# EAGLE design 01A-005 (EAGLE 9.6.2)
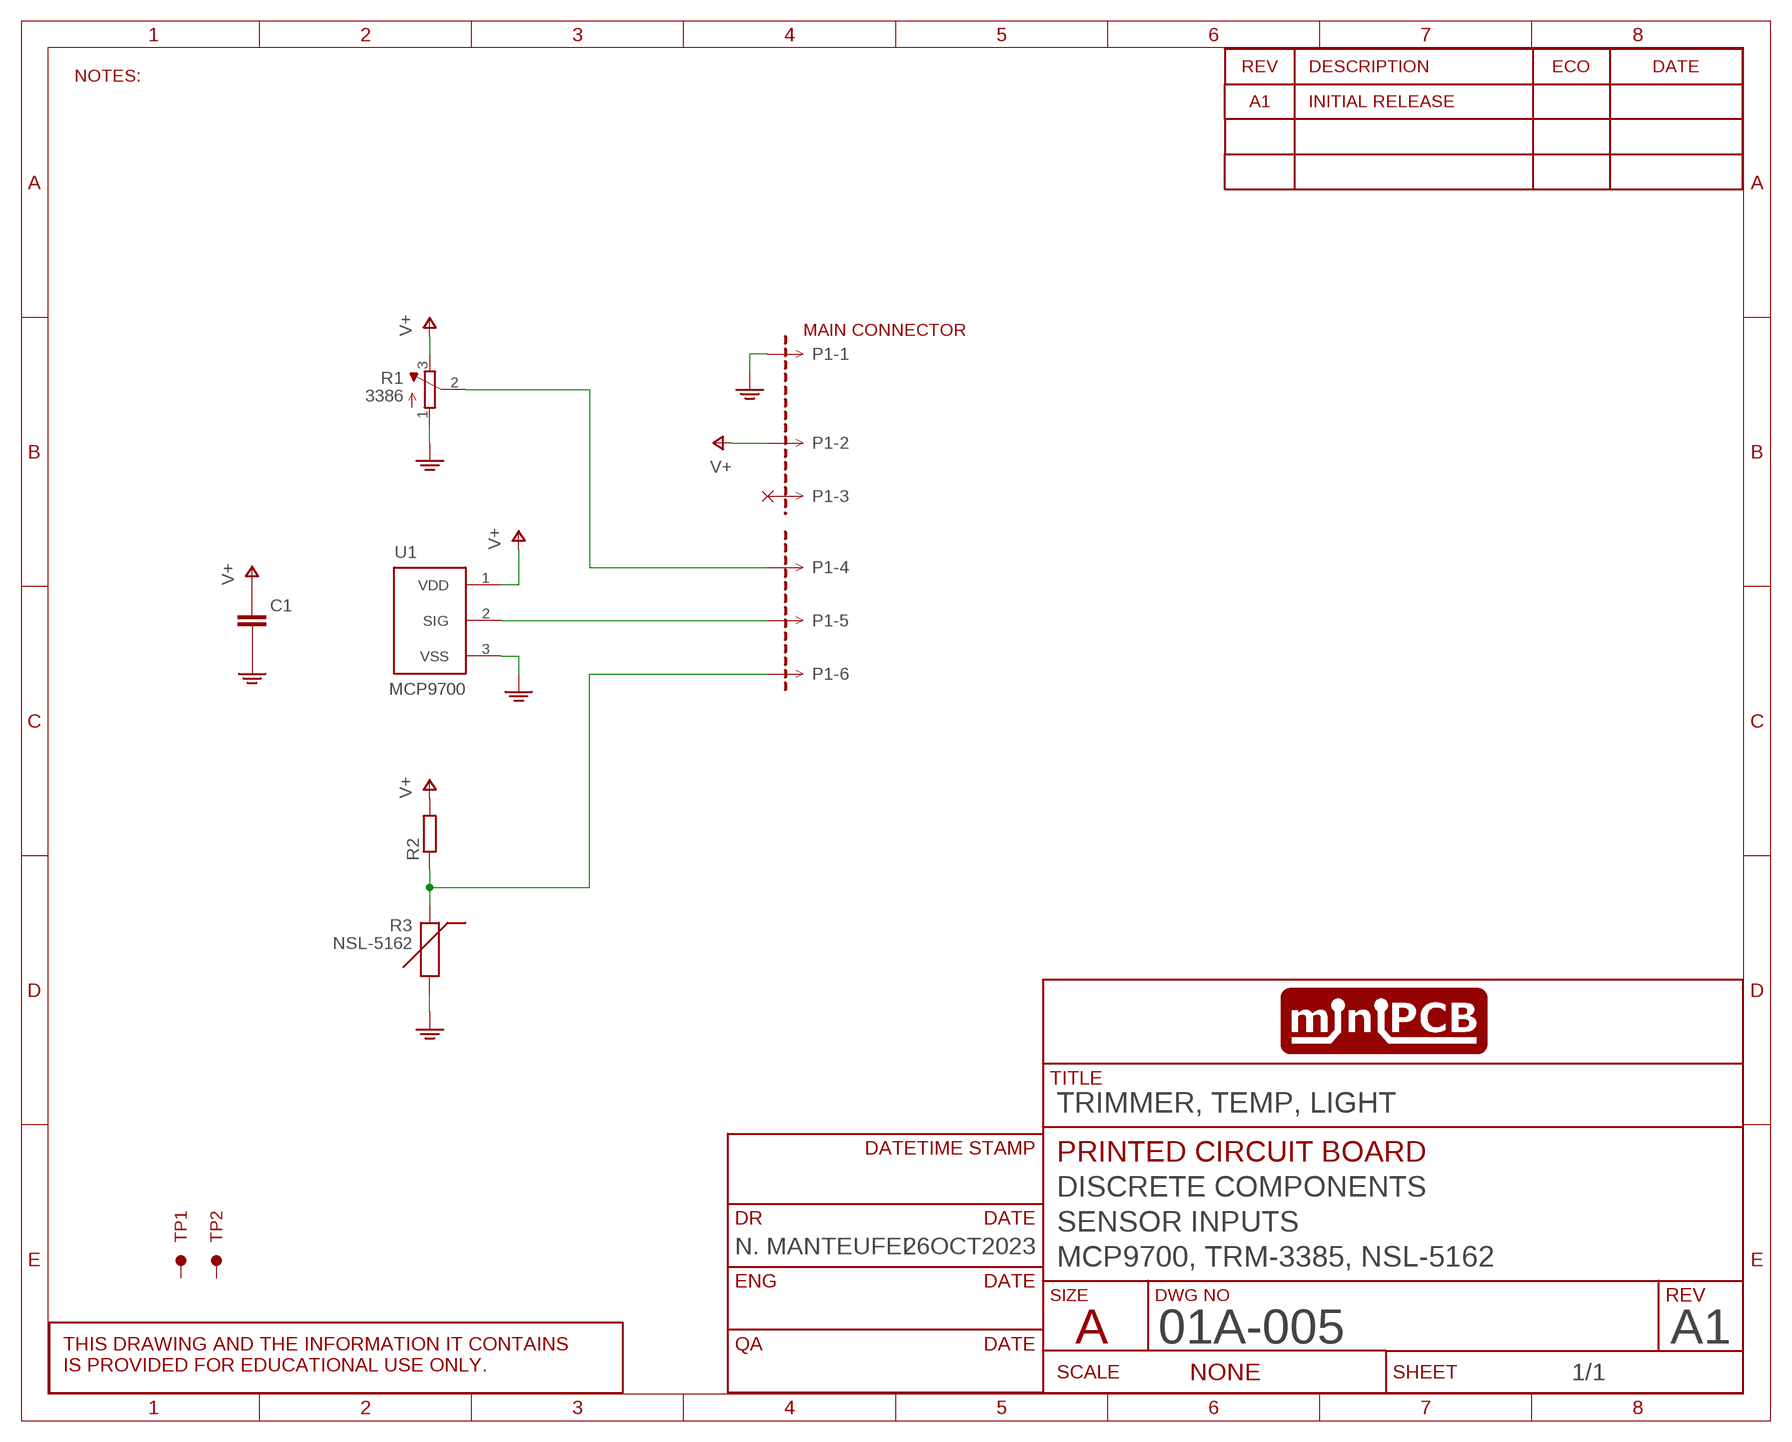
[diagram p0: schematic, sheet 1]
SHEET1 (SCHEMATIC): CIRCUIT_CATEGORY: DISCRETE COMPONENTS; CIRCUIT_NAME: SENSOR INPUTS; CIRCUIT_VARIANT: MCP9700, TRM-3385, NSL-5162; DR: N. MANTEUFEL; DR_DATE: 26OCT2023; PCB_PCBA: PRINTED CIRCUIT BOARD; REVA: A1; REVISION: A1; TITLE: TRIMMER, TEMP, LIGHT

## Parts
C1  CAPACITORSMD  [C0805]
P1  MINIPCB_6P  [PINS_6]
PCB1  MAIN CONNECTOR  MINIPCB_0P00A-20X50  [MINIPCB_00A_20X50]
R1  3386  TRIMPOT3386  [TRIM-3386]
R2  RESISTORSMD  [R0805]
R3  NSL-5162  CERAMICPHOTOCELL  [CERAMICPHOTOCELL]
TP1  TESTPOINTFIDUCIAL  [FIDUCIAL]
TP2  TESTPOINTFIDUCIAL  [FIDUCIAL]
U1  MCP9700  [SOT23]

## Nets
GND: C1.2ASDF(-) P1.1 R1.1(A) R3.P$2 U1.3(VSS)
N$1: P1.5 U1.2(SIG)
N$2: P1.4 R1.2(S)
N$3: P1.6 R2.1 R3.P$1
V+: C1.1ASD(+) P1.2 R1.3(E) R2.2 U1.1(VDD)
Unconnected: P1.3 TP1.FIDUCIAL TP2.FIDUCIAL

## Notes on the sheet
- NOTES:

## Library data of the parts
C1 = minipcb:CAPACITOR
P1 = minipcb:MINIPCB_6P
PCB1 = minipcb:MINIPCB_0P; CIRCUIT_CATEGORY: DISCRETE COMPONENTS; PART_NUMBER: 01A-005; REVISION: A1-01; TITLE: SENSOR AFE
R1 = minipcb:TRIMPOT: SMT trimmer potentiometer part number TC33X http://www.ladyada.net/library/eagle
R2 = minipcb:RESISTOR
R3 = minipcb:CERAMICPHOTOCELL
TP1 TP2 = minipcb:TESTPOINT
U1 = minipcb:MCP9700

## Board
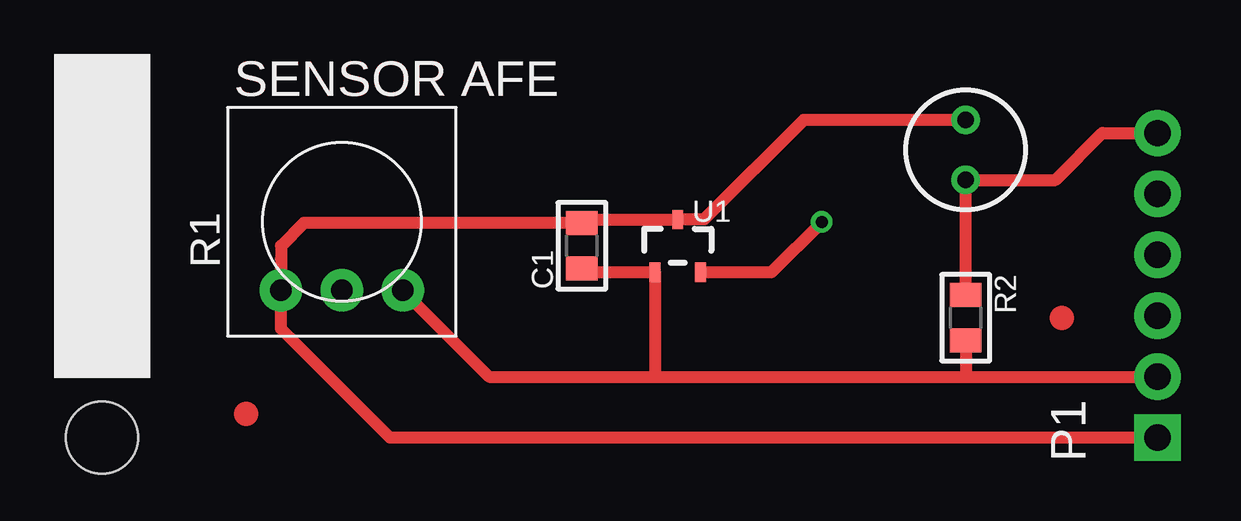
[diagram p1: board, top side]
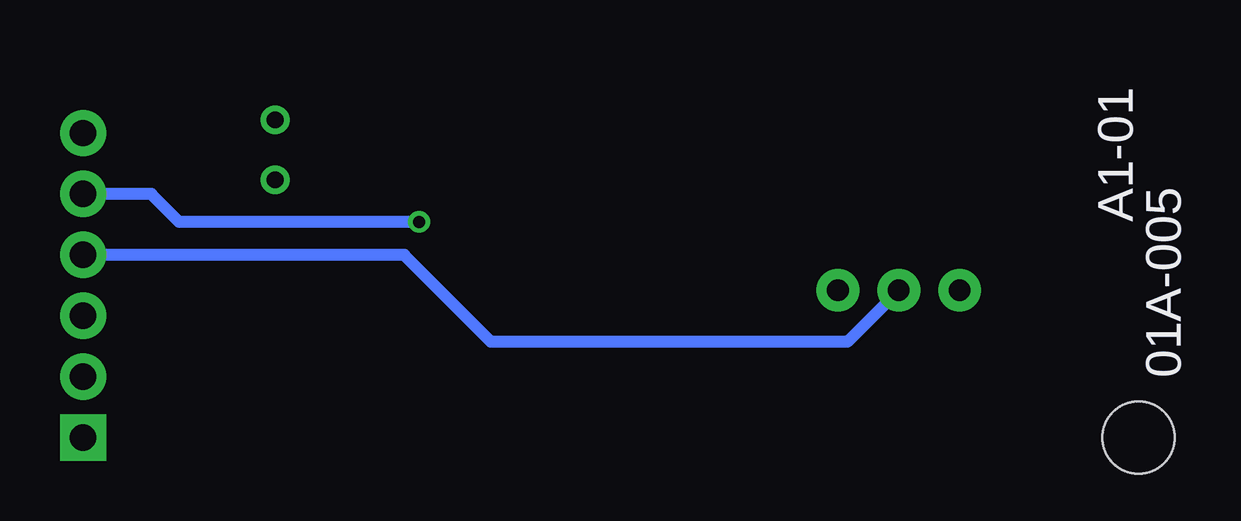
[diagram p2: board, bottom side, seen from below]

No outline drawn. Coordinates in mm, seen from the top.
Copper layers (1*16): Top 0.035mm / dielectric 1.5mm / Bottom 0.035mm
Design rules "default": minimum track width 6mil, minimum drill 0.35mm, track to track 6mil, track to pad 6mil, pad to pad 6mil, via to via 6mil, smd to smd 6mil, copper to edge 40mil, drill to drill 6mil, minimum pad ring 10mil, minimum via ring 8mil, stop-mask expansion 4mil, vias tented up to drill 0mil, thermal gap 10mil

### Footprints (pad centres in the part's own frame; a part is rotated, then mirrored left to right if it is on the bottom)
C0805 = smd 1 x 1.3: 1ASD -0.95,0; 2ASDF 0.95,0
PINS_6 = drill 1.1 pad 1.93 square: 1 0,0 | drill 1.1 pad 1.93: 2 2.54,0; 3 5.08,0; 4 7.62,0; 5 10.16,0; 6 12.7,0
MINIPCB_00A_20X50 = hole 3: 3,3
TRIM-3386 = drill 0.9 pad 1.778: 1 -2.54,-2.857; 2 0,-2.857; 3 2.54,-2.857
R0805 = smd 1 x 1.3: 1 -0.95,0; 2 0.95,0
CERAMICPHOTOCELL = drill 0.7: P$1 -1.25,0; P$2 1.25,0
FIDUCIAL = smd 0 x 0: FIDUCIAL 0,0
SOT23 = smd 0.45 x 0.8: 1 -0.95,-1.1; 2 0.95,-1.1; 3 0,1.1

### Placement (x,y rotation side)
C1  23,11 90 top
P1  47,3 90 top
PCB1  0,0 0 top
R1  13,12 0 top
R2  39,8 270 top
R3  39,15 90 top
TP1  9,4 0 top
TP2  43,8 0 top
U1  27,11 0 top

### Tracks (layer width: path | path; a pad name or v marks a point on that pad's centre or on a via)
GND
  Top 0.5: P1.1 15,3 10.46,7.54 R1.1 10.46,10 10.46,10.46 10.46,11 11.41,11.95 C1.2ASDF 23.15,12.1 U1.3 28.1,12.1 32.25,16.25 R3.P$2
N$1  (via drill 0.5)
  Top 0.5: U1.2 30.9,9.9 v33,12
  Bottom 0.5: v33,12 43,12 44.16,13.16 P1.5
N$2
  Bottom 0.5: R1.2 15.14,7 30,7 33.62,10.62 P1.4
N$3
  Top 0.5: R2.1 R3.P$1 42.75,13.75 44.7,15.7 P1.6
V+
  Top 0.5: R1.3 19.14,5.54 26,5.54 | 26,5.54 39,5.54 | 39,5.54 P1.2 | 26,5.54 26.05,5.59 U1.1 23.15,9.9 C1.1ASD | R2.2 39,5.54

### Text on the board
_tNames: U1 | R1 | R2 | C1 | P1